# EAGLE schematic infinity-mirror-clock (EAGLE 6.3)
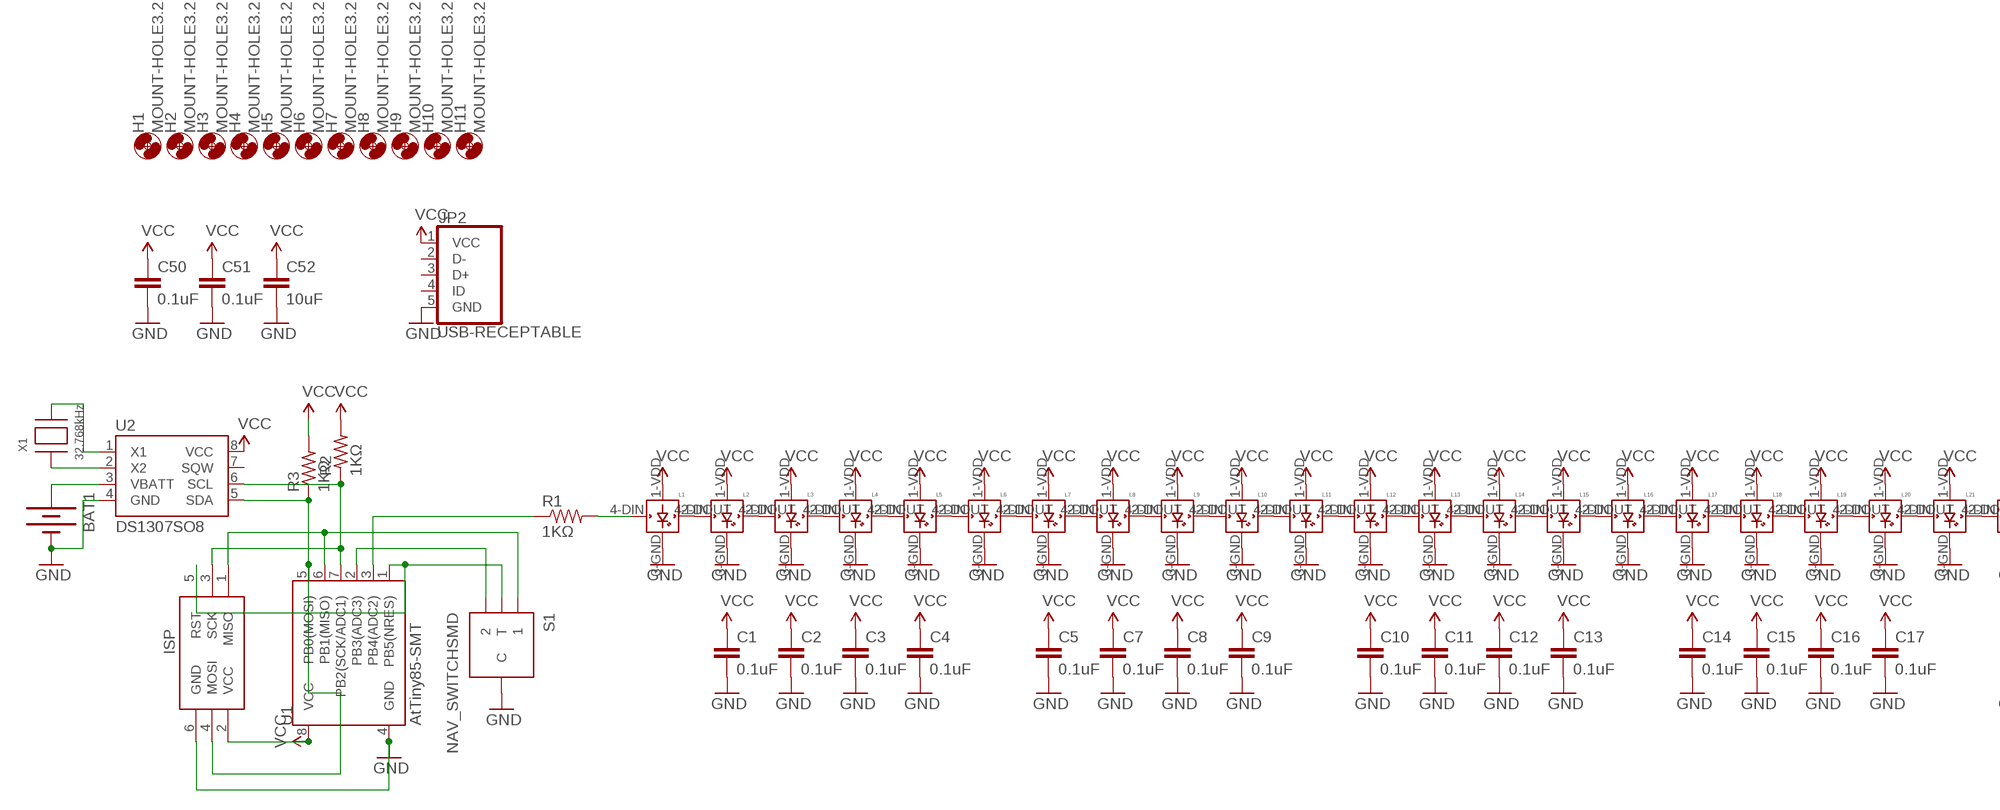
[diagram p0: schematic, sheet 1, part 1 of 2]
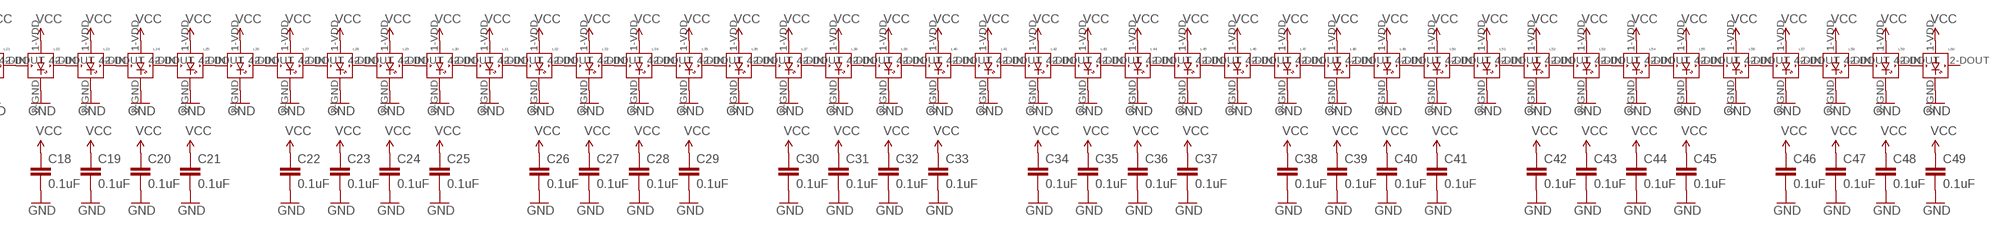
[diagram p1: schematic, sheet 1, part 2 of 2]

## Parts
BAT1  BATTERY12MM  [BATTCON_12MM]
C1  0.1uF  0.1UF-25V-5%(0603)  [0603-CAP]
C2  0.1uF  0.1UF-25V-5%(0603)  [0603-CAP]
C3  0.1uF  0.1UF-25V-5%(0603)  [0603-CAP]
C4  0.1uF  0.1UF-25V-5%(0603)  [0603-CAP]
C5  0.1uF  0.1UF-25V-5%(0603)  [0603-CAP]
C7  0.1uF  0.1UF-25V-5%(0603)  [0603-CAP]
C8  0.1uF  0.1UF-25V-5%(0603)  [0603-CAP]
C9  0.1uF  0.1UF-25V-5%(0603)  [0603-CAP]
C10  0.1uF  0.1UF-25V-5%(0603)  [0603-CAP]
C11  0.1uF  0.1UF-25V-5%(0603)  [0603-CAP]
C12  0.1uF  0.1UF-25V-5%(0603)  [0603-CAP]
C13  0.1uF  0.1UF-25V-5%(0603)  [0603-CAP]
C14  0.1uF  0.1UF-25V-5%(0603)  [0603-CAP]
C15  0.1uF  0.1UF-25V-5%(0603)  [0603-CAP]
C16  0.1uF  0.1UF-25V-5%(0603)  [0603-CAP]
C17  0.1uF  0.1UF-25V-5%(0603)  [0603-CAP]
C18  0.1uF  0.1UF-25V-5%(0603)  [0603-CAP]
C19  0.1uF  0.1UF-25V-5%(0603)  [0603-CAP]
C20  0.1uF  0.1UF-25V-5%(0603)  [0603-CAP]
C21  0.1uF  0.1UF-25V-5%(0603)  [0603-CAP]
C22  0.1uF  0.1UF-25V-5%(0603)  [0603-CAP]
C23  0.1uF  0.1UF-25V-5%(0603)  [0603-CAP]
C24  0.1uF  0.1UF-25V-5%(0603)  [0603-CAP]
C25  0.1uF  0.1UF-25V-5%(0603)  [0603-CAP]
C26  0.1uF  0.1UF-25V-5%(0603)  [0603-CAP]
C27  0.1uF  0.1UF-25V-5%(0603)  [0603-CAP]
C28  0.1uF  0.1UF-25V-5%(0603)  [0603-CAP]
C29  0.1uF  0.1UF-25V-5%(0603)  [0603-CAP]
C30  0.1uF  0.1UF-25V-5%(0603)  [0603-CAP]
C31  0.1uF  0.1UF-25V-5%(0603)  [0603-CAP]
C32  0.1uF  0.1UF-25V-5%(0603)  [0603-CAP]
C33  0.1uF  0.1UF-25V-5%(0603)  [0603-CAP]
C34  0.1uF  0.1UF-25V-5%(0603)  [0603-CAP]
C35  0.1uF  0.1UF-25V-5%(0603)  [0603-CAP]
C36  0.1uF  0.1UF-25V-5%(0603)  [0603-CAP]
C37  0.1uF  0.1UF-25V-5%(0603)  [0603-CAP]
C38  0.1uF  0.1UF-25V-5%(0603)  [0603-CAP]
C39  0.1uF  0.1UF-25V-5%(0603)  [0603-CAP]
C40  0.1uF  0.1UF-25V-5%(0603)  [0603-CAP]
C41  0.1uF  0.1UF-25V-5%(0603)  [0603-CAP]
C42  0.1uF  0.1UF-25V-5%(0603)  [0603-CAP]
C43  0.1uF  0.1UF-25V-5%(0603)  [0603-CAP]
C44  0.1uF  0.1UF-25V-5%(0603)  [0603-CAP]
C45  0.1uF  0.1UF-25V-5%(0603)  [0603-CAP]
C46  0.1uF  0.1UF-25V-5%(0603)  [0603-CAP]
C47  0.1uF  0.1UF-25V-5%(0603)  [0603-CAP]
C48  0.1uF  0.1UF-25V-5%(0603)  [0603-CAP]
C49  0.1uF  0.1UF-25V-5%(0603)  [0603-CAP]
C50  0.1uF  0.1UF-25V-5%(0603)  [0603-CAP]
C51  0.1uF  0.1UF-25V-5%(0603)  [0603-CAP]
C52  10uF  10UF-6.3V-20%(0603)  [0603-CAP]
H1  MOUNT-HOLE3.2  [3,2]
H2  MOUNT-HOLE3.2  [3,2]
H3  MOUNT-HOLE3.2  [3,2]
H4  MOUNT-HOLE3.2  [3,2]
H5  MOUNT-HOLE3.2  [3,2]
H6  MOUNT-HOLE3.2  [3,2]
H7  MOUNT-HOLE3.2  [3,2]
H8  MOUNT-HOLE3.2  [3,2]
H9  MOUNT-HOLE3.2  [3,2]
H10  MOUNT-HOLE3.2  [3,2]
H11  MOUNT-HOLE3.2  [3,2]
ISP  AVRISPAVRSMTISP  [AVRSMTISP]
JP2  USB-RECEPTABLE  [FCI-10103594-0001LF]
L1  WS2812B  [WS2812B]
L2  WS2812B  [WS2812B]
L3  WS2812B  [WS2812B]
L4  WS2812B  [WS2812B]
L5  WS2812B  [WS2812B]
L6  WS2812B  [WS2812B]
L7  WS2812B  [WS2812B]
L8  WS2812B  [WS2812B]
L9  WS2812B  [WS2812B]
L10  WS2812B  [WS2812B]
L11  WS2812B  [WS2812B]
L12  WS2812B  [WS2812B]
L13  WS2812B  [WS2812B]
L14  WS2812B  [WS2812B]
L15  WS2812B  [WS2812B]
L16  WS2812B  [WS2812B]
L17  WS2812B  [WS2812B]
L18  WS2812B  [WS2812B]
L19  WS2812B  [WS2812B]
L20  WS2812B  [WS2812B]
L21  WS2812B  [WS2812B]
L22  WS2812B  [WS2812B]
L23  WS2812B  [WS2812B]
L24  WS2812B  [WS2812B]
L25  WS2812B  [WS2812B]
L26  WS2812B  [WS2812B]
L27  WS2812B  [WS2812B]
L28  WS2812B  [WS2812B]
L29  WS2812B  [WS2812B]
L30  WS2812B  [WS2812B]
L31  WS2812B  [WS2812B]
L32  WS2812B  [WS2812B]
L33  WS2812B  [WS2812B]
L34  WS2812B  [WS2812B]
L35  WS2812B  [WS2812B]
L36  WS2812B  [WS2812B]
L37  WS2812B  [WS2812B]
L38  WS2812B  [WS2812B]
L39  WS2812B  [WS2812B]
L40  WS2812B  [WS2812B]
L41  WS2812B  [WS2812B]
L42  WS2812B  [WS2812B]
L43  WS2812B  [WS2812B]
L44  WS2812B  [WS2812B]
L45  WS2812B  [WS2812B]
L46  WS2812B  [WS2812B]
L47  WS2812B  [WS2812B]
L48  WS2812B  [WS2812B]
L49  WS2812B  [WS2812B]
L50  WS2812B  [WS2812B]
L51  WS2812B  [WS2812B]
L52  WS2812B  [WS2812B]
L53  WS2812B  [WS2812B]
L54  WS2812B  [WS2812B]
L55  WS2812B  [WS2812B]
L56  WS2812B  [WS2812B]
L57  WS2812B  [WS2812B]
L58  WS2812B  [WS2812B]
L59  WS2812B  [WS2812B]
L60  WS2812B  [WS2812B]
R1  1KΩ  680OHM1/10W5%(0603)  [0603-RES]
R2  1KΩ  R-US_R0603  [R0603]
R3  1KΩ  R-US_R0603  [R0603]
S1  NAV_SWITCHSMD  [NAV_SWITCH]
U1  AtTiny85-SMT  ATTINY45TINY45-20-SMT  [SO08-EIAJ]
U2  DS1307SO8  [SO08]
X1  32.768kHz  XTAL-3.2X1.5  [XTAL3215]

## Nets
GND: BAT1.GND(-) C1.2 C2.2 C3.2 C4.2 C5.2 C7.2 C8.2 C9.2 C10.2 C11.2 C12.2 C13.2 C14.2 C15.2 C16.2 C17.2 C18.2 C19.2 C20.2 C21.2 C22.2 C23.2 C24.2 C25.2 C26.2 C27.2 C28.2 C29.2 C30.2 C31.2 C32.2 C33.2 C34.2 C35.2 C36.2 C37.2 C38.2 C39.2 C40.2 C41.2 C42.2 C43.2 C44.2 C45.2 C46.2 C47.2 C48.2 C49.2 C50.2 C51.2 C52.2 ISP.6(GND) JP2.5(GND) L1.3-GND(GND) L2.3-GND(GND) L3.3-GND(GND) L4.3-GND(GND) L5.3-GND(GND) L6.3-GND(GND) L7.3-GND(GND) L8.3-GND(GND) L9.3-GND(GND) L10.3-GND(GND) L11.3-GND(GND) L12.3-GND(GND) L13.3-GND(GND) L14.3-GND(GND) L15.3-GND(GND) L16.3-GND(GND) L17.3-GND(GND) L18.3-GND(GND) L19.3-GND(GND) L20.3-GND(GND) L21.3-GND(GND) L22.3-GND(GND) L23.3-GND(GND) L24.3-GND(GND) L25.3-GND(GND) L26.3-GND(GND) L27.3-GND(GND) L28.3-GND(GND) L29.3-GND(GND) L30.3-GND(GND) L31.3-GND(GND) L32.3-GND(GND) L33.3-GND(GND) L34.3-GND(GND) L35.3-GND(GND) L36.3-GND(GND) L37.3-GND(GND) L38.3-GND(GND) L39.3-GND(GND) L40.3-GND(GND) L41.3-GND(GND) L42.3-GND(GND) L43.3-GND(GND) L44.3-GND(GND) L45.3-GND(GND) L46.3-GND(GND) L47.3-GND(GND) L48.3-GND(GND) L49.3-GND(GND) L50.3-GND(GND) L51.3-GND(GND) L52.3-GND(GND) L53.3-GND(GND) L54.3-GND(GND) L55.3-GND(GND) L56.3-GND(GND) L57.3-GND(GND) L58.3-GND(GND) L59.3-GND(GND) L60.3-GND(GND) S1.C U1.4(GND) U2.4(GND)
N$1: L1.2-DOUT(DOUT) L2.4-DIN(DIN)
N$2: L2.2-DOUT(DOUT) L3.4-DIN(DIN)
N$3: L3.2-DOUT(DOUT) L4.4-DIN(DIN)
N$4: L4.2-DOUT(DOUT) L5.4-DIN(DIN)
N$5: L5.2-DOUT(DOUT) L6.4-DIN(DIN)
N$6: L7.2-DOUT(DOUT) L8.4-DIN(DIN)
N$7: L8.2-DOUT(DOUT) L9.4-DIN(DIN)
N$8: L9.2-DOUT(DOUT) L10.4-DIN(DIN)
N$9: L10.2-DOUT(DOUT) L11.4-DIN(DIN)
N$10: L11.2-DOUT(DOUT) L12.4-DIN(DIN)
N$11: L13.2-DOUT(DOUT) L14.4-DIN(DIN)
N$12: L14.2-DOUT(DOUT) L15.4-DIN(DIN)
N$13: L15.2-DOUT(DOUT) L16.4-DIN(DIN)
N$14: L16.2-DOUT(DOUT) L17.4-DIN(DIN)
N$15: L17.2-DOUT(DOUT) L18.4-DIN(DIN)
N$16: L19.2-DOUT(DOUT) L20.4-DIN(DIN)
N$17: L20.2-DOUT(DOUT) L21.4-DIN(DIN)
N$18: L21.2-DOUT(DOUT) L22.4-DIN(DIN)
N$19: L22.2-DOUT(DOUT) L23.4-DIN(DIN)
N$20: L23.2-DOUT(DOUT) L24.4-DIN(DIN)
N$21: L25.2-DOUT(DOUT) L26.4-DIN(DIN)
N$22: L26.2-DOUT(DOUT) L27.4-DIN(DIN)
N$23: L27.2-DOUT(DOUT) L28.4-DIN(DIN)
N$24: L28.2-DOUT(DOUT) L29.4-DIN(DIN)
N$25: L29.2-DOUT(DOUT) L30.4-DIN(DIN)
N$26: L31.2-DOUT(DOUT) L32.4-DIN(DIN)
N$27: L32.2-DOUT(DOUT) L33.4-DIN(DIN)
N$28: L33.2-DOUT(DOUT) L34.4-DIN(DIN)
N$29: L34.2-DOUT(DOUT) L35.4-DIN(DIN)
N$30: L35.2-DOUT(DOUT) L36.4-DIN(DIN)
N$31: L37.2-DOUT(DOUT) L38.4-DIN(DIN)
N$32: L38.2-DOUT(DOUT) L39.4-DIN(DIN)
N$33: L39.2-DOUT(DOUT) L40.4-DIN(DIN)
N$34: L40.2-DOUT(DOUT) L41.4-DIN(DIN)
N$35: L41.2-DOUT(DOUT) L42.4-DIN(DIN)
N$36: L43.2-DOUT(DOUT) L44.4-DIN(DIN)
N$37: L44.2-DOUT(DOUT) L45.4-DIN(DIN)
N$38: L45.2-DOUT(DOUT) L46.4-DIN(DIN)
N$39: L46.2-DOUT(DOUT) L47.4-DIN(DIN)
N$40: L47.2-DOUT(DOUT) L48.4-DIN(DIN)
N$41: L49.2-DOUT(DOUT) L50.4-DIN(DIN)
N$42: L50.2-DOUT(DOUT) L51.4-DIN(DIN)
N$43: L51.2-DOUT(DOUT) L52.4-DIN(DIN)
N$44: L52.2-DOUT(DOUT) L53.4-DIN(DIN)
N$45: L53.2-DOUT(DOUT) L54.4-DIN(DIN)
N$46: L55.2-DOUT(DOUT) L56.4-DIN(DIN)
N$47: L56.2-DOUT(DOUT) L57.4-DIN(DIN)
N$48: L57.2-DOUT(DOUT) L58.4-DIN(DIN)
N$49: L58.2-DOUT(DOUT) L59.4-DIN(DIN)
N$50: L59.2-DOUT(DOUT) L60.4-DIN(DIN)
N$51: L1.4-DIN(DIN) R1.2
N$52: U2.2(X2) X1.P$1
N$53: U2.1(X1) X1.P$2
N$54: BAT1.PWR@1(+) U2.3(VBATT)
N$55: ISP.3(SCK) R2.1 U1.7(PB2(SCK/ADC1)) U2.6(SCL)
N$56: ISP.4(MOSI) R3.1 U1.5(PB0(MOSI)) U2.5(SDA)
N$57: ISP.1(MISO) S1.1 U1.6(PB1(MISO))
N$58: S1.2 U1.2(PB3(ADC3))
N$59: ISP.5(RST) S1.T U1.1(PB5(NRES))
N$60: R1.1 U1.3(PB4(ADC2))
N$61: L30.2-DOUT(DOUT) L31.4-DIN(DIN)
N$62: L24.2-DOUT(DOUT) L25.4-DIN(DIN)
N$63: L18.2-DOUT(DOUT) L19.4-DIN(DIN)
N$64: L12.2-DOUT(DOUT) L13.4-DIN(DIN)
N$65: L36.2-DOUT(DOUT) L37.4-DIN(DIN)
N$66: L42.2-DOUT(DOUT) L43.4-DIN(DIN)
N$67: L48.2-DOUT(DOUT) L49.4-DIN(DIN)
N$68: L54.2-DOUT(DOUT) L55.4-DIN(DIN)
N$69: L6.2-DOUT(DOUT) L7.4-DIN(DIN)
VCC: C1.1 C2.1 C3.1 C4.1 C5.1 C7.1 C8.1 C9.1 C10.1 C11.1 C12.1 C13.1 C14.1 C15.1 C16.1 C17.1 C18.1 C19.1 C20.1 C21.1 C22.1 C23.1 C24.1 C25.1 C26.1 C27.1 C28.1 C29.1 C30.1 C31.1 C32.1 C33.1 C34.1 C35.1 C36.1 C37.1 C38.1 C39.1 C40.1 C41.1 C42.1 C43.1 C44.1 C45.1 C46.1 C47.1 C48.1 C49.1 C50.1 C51.1 C52.1 ISP.2(VCC) JP2.1(VCC) L1.1-VDD(VDD) L2.1-VDD(VDD) L3.1-VDD(VDD) L4.1-VDD(VDD) L5.1-VDD(VDD) L6.1-VDD(VDD) L7.1-VDD(VDD) L8.1-VDD(VDD) L9.1-VDD(VDD) L10.1-VDD(VDD) L11.1-VDD(VDD) L12.1-VDD(VDD) L13.1-VDD(VDD) L14.1-VDD(VDD) L15.1-VDD(VDD) L16.1-VDD(VDD) L17.1-VDD(VDD) L18.1-VDD(VDD) L19.1-VDD(VDD) L20.1-VDD(VDD) L21.1-VDD(VDD) L22.1-VDD(VDD) L23.1-VDD(VDD) L24.1-VDD(VDD) L25.1-VDD(VDD) L26.1-VDD(VDD) L27.1-VDD(VDD) L28.1-VDD(VDD) L29.1-VDD(VDD) L30.1-VDD(VDD) L31.1-VDD(VDD) L32.1-VDD(VDD) L33.1-VDD(VDD) L34.1-VDD(VDD) L35.1-VDD(VDD) L36.1-VDD(VDD) L37.1-VDD(VDD) L38.1-VDD(VDD) L39.1-VDD(VDD) L40.1-VDD(VDD) L41.1-VDD(VDD) L42.1-VDD(VDD) L43.1-VDD(VDD) L44.1-VDD(VDD) L45.1-VDD(VDD) L46.1-VDD(VDD) L47.1-VDD(VDD) L48.1-VDD(VDD) L49.1-VDD(VDD) L50.1-VDD(VDD) L51.1-VDD(VDD) L52.1-VDD(VDD) L53.1-VDD(VDD) L54.1-VDD(VDD) L55.1-VDD(VDD) L56.1-VDD(VDD) L57.1-VDD(VDD) L58.1-VDD(VDD) L59.1-VDD(VDD) L60.1-VDD(VDD) R2.2 R3.2 U1.8(VCC) U2.8(VCC)
Unconnected: JP2.2(D-) JP2.3(D+) JP2.4(ID) L60.2-DOUT(DOUT) U2.7(SQW)

## Library data of the parts
BAT1 = SparkFun-Electromechanical:BATTERY: Battery Holders Various common sizes : AA, AAA, 20mm coin cell and 12mm coin cell. 20MM_4LEGS, BATT-10373
C1-C5 C7-C51 = SparkFun-Capacitors:0.1UF-25V-5%(0603): CAP-08604; PROD_ID: CAP-08604
C52 = SparkFun-Capacitors:10UF-6.3V-20%(0603): CAP-11015; PROD_ID: CAP-11015
H1-H11 = holes:MOUNT-HOLE: MOUNTING HOLE with drill center marker
ISP = adafruit:AVRISP: AVR ISP HEADER Standard 6 pin header for AVR programming
JP2 = daspilker:USB-RECEPTABLE: USB Receptable
L1-L60 = adafruit:WS2812B
R1 = SparkFun-Resistors:680OHM1/10W5%(0603): RES-09333; PROD_ID: RES-09333; VALUE: 680
R2 R3 = adafruit:R-US_: RESISTOR, American symbol
S1 = SparkFun-Electromechanical:NAV_SWITCH: Navigation Switch Three way navigation switch. Commonly used as up/down/select on MP3 players. Schematic element and footprint production proven. Spark Fun Electronics SKU : COM-08184
U1 = SparkFun-DigitalIC:ATTINY45: Atmel 8-pin 2/4/8kB flash uC; PROD_ID: IC-08922; VALUE: Tiny45-20-SMT
U2 = SparkFun-FreqCtrl:DS1307: I2C real-time clock with battery backup.
X1 = adafruit:XTAL: Low cost SMT crystals, no capacitors included http://www.ladyada.net/library/eagle